# Altium schematic sheet POWER_Ctrl.SchDoc
size A4
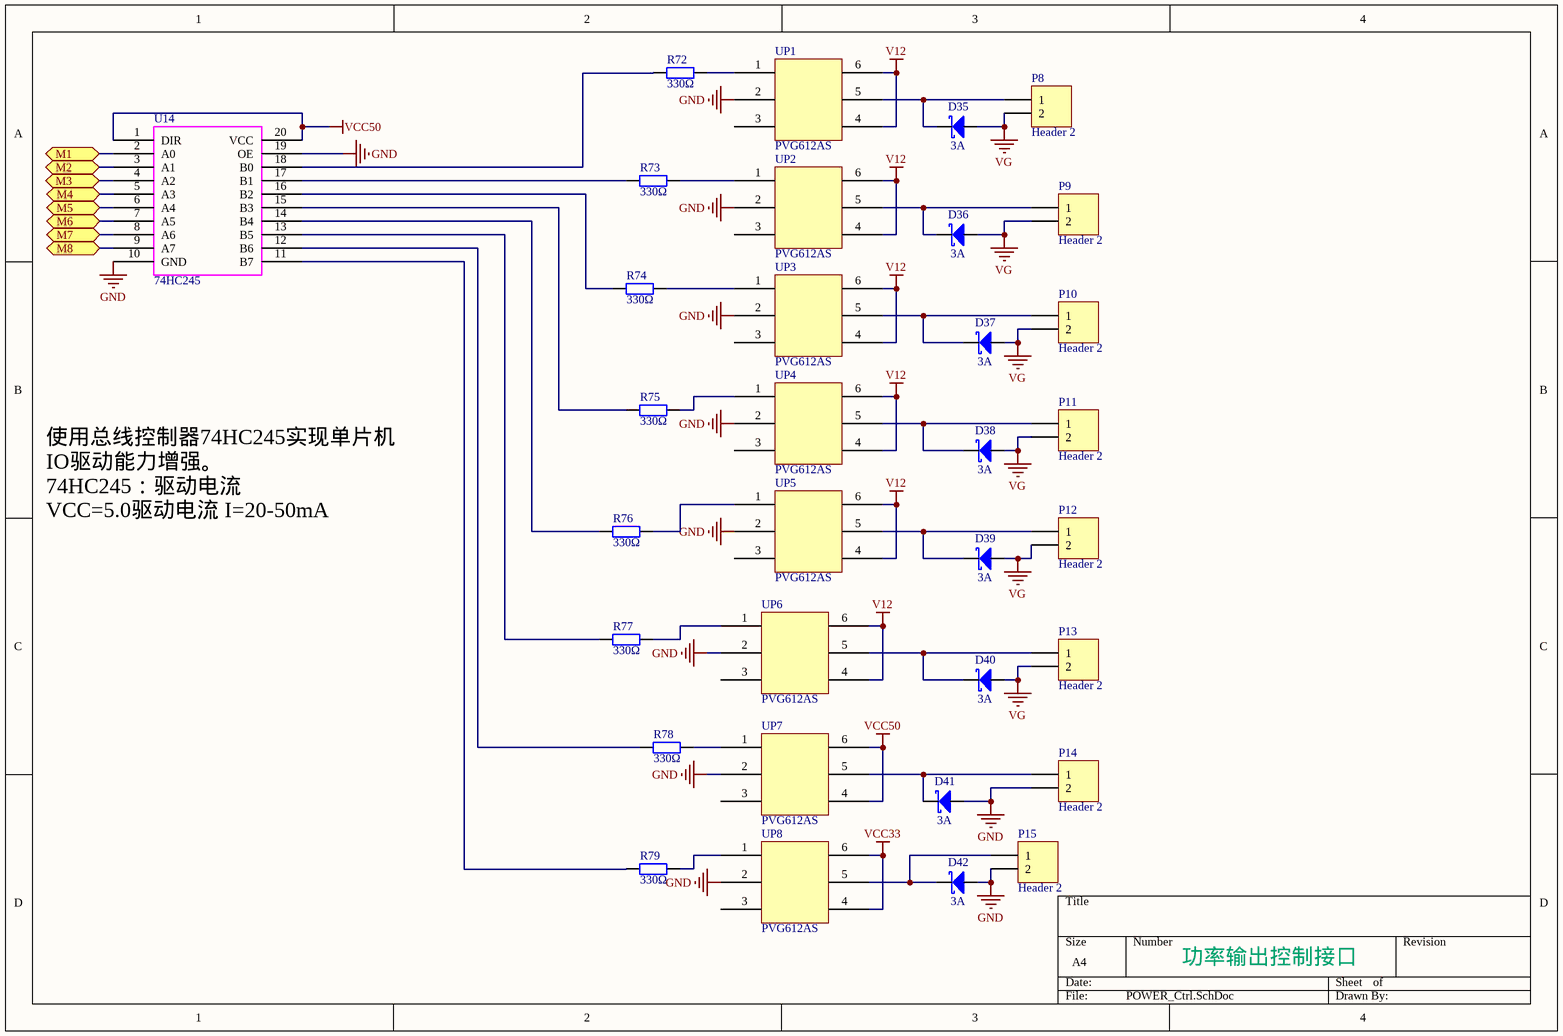
[diagram p0: POWER_Ctrl.SchDoc]

## Parts
D35  DIO Current: 3A  [SMA]  (hidden comment: DiodeSchottky)
D36  DIO Current: 3A  [SMA]  (hidden comment: DiodeSchottky)
D37  DIO Current: 3A  [SMA]  (hidden comment: DiodeSchottky)
D38  DIO Current: 3A  [SMA]  (hidden comment: DiodeSchottky)
D39  DIO Current: 3A  [SMA]  (hidden comment: DiodeSchottky)
D40  DIO Current: 3A  [SMA]  (hidden comment: DiodeSchottky)
D41  DIO Current: 3A  [SMA]  (hidden comment: DiodeSchottky)
D42  DIO Current: 3A  [SMA]  (hidden comment: DiodeSchottky)
P8  Header 2  [3.81-2P]
P9  Header 2  [3.81-2P]
P10  Header 2  [3.81-2P]
P11  Header 2  [3.81-2P]
P12  Header 2  [3.81-2P]
P13  Header 2  [3.81-2P]
P14  Header 2  [3.81-2P]
P15  Header 2  [3.81-2P]
R72  value 330Ω  [1206]  (hidden comment: Res2)
R73  value 330Ω  [1206]  (hidden comment: Res2)
R74  value 330Ω  [1206]  (hidden comment: Res2)
R75  value 330Ω  [1206]  (hidden comment: Res2)
R76  value 330Ω  [1206]  (hidden comment: Res2)
R77  value 330Ω  [1206]  (hidden comment: Res2)
R78  value 330Ω  [1206]  (hidden comment: Res2)
R79  value 330Ω  [1206]  (hidden comment: Res2)
U14  74HC245  [74HC245D]
UP1  PVG612AS  [SMD-6]
UP2  PVG612AS  [SMD-6]
UP3  PVG612AS  [SMD-6]
UP4  PVG612AS  [SMD-6]
UP5  PVG612AS  [SMD-6]
UP6  PVG612AS  [SMD-6]
UP7  PVG612AS  [SMD-6]
UP8  PVG612AS  [SMD-6]

## Ports
M1 (bidir), M2 (bidir), M3 (bidir), M4 (bidir), M5 (bidir), M6 (bidir), M7 (bidir), M8 (bidir)

## Nets
GND: D41.1 D42.1 P14.2 P15.2 U14.10(GND) U14.19(OE) UP1.2 UP2.2 UP3.2 UP4.2 UP5.2 UP6.2 UP7.2 UP8.2
V12: UP1.4 UP1.6 UP2.4 UP2.6 UP3.4 UP3.6 UP4.4 UP4.6 UP5.4 UP5.6 UP6.4 UP6.6
VCC33: UP8.4 UP8.6
VCC50: U14.1(DIR) U14.20(VCC) UP7.4 UP7.6
VG: D35.1 D36.1 D37.1 D38.1 D39.1 D40.1 P8.2 P9.2 P10.2 P11.2 P12.2 P13.2
M1: U14.2(A0) ; port M1
M2: U14.3(A1) ; port M2
M3: U14.4(A2) ; port M3
M4: U14.5(A3) ; port M4
M5: U14.6(A4) ; port M5
M6: U14.7(A5) ; port M6
M7: U14.8(A6) ; port M7
M8: U14.9(A7) ; port M8
NetD35_2: D35.2 P8.1 UP1.5
NetD36_2: D36.2 P9.1 UP2.5
NetD37_2: D37.2 P10.1 UP3.5
NetD38_2: D38.2 P11.1 UP4.5
NetD39_2: D39.2 P12.1 UP5.5
NetD40_2: D40.2 P13.1 UP6.5
NetD41_2: D41.2 P14.1 UP7.5
NetD42_2: D42.2 P15.1 UP8.5
NetR72_1: R72.1 UP1.1
NetR72_2: R72.2 U14.18(B0)
NetR73_1: R73.1 UP2.1
NetR73_2: R73.2 U14.17(B1)
NetR74_1: R74.1 UP3.1
NetR74_2: R74.2 U14.16(B2)
NetR75_1: R75.1 UP4.1
NetR75_2: R75.2 U14.15(B3)
NetR76_1: R76.1 UP5.1
NetR76_2: R76.2 U14.14(B4)
NetR77_1: R77.1 UP6.1
NetR77_2: R77.2 U14.13(B5)
NetR78_1: R78.1 UP7.1
NetR78_2: R78.2 U14.12(B6)
NetR79_1: R79.1 UP8.1
NetR79_2: R79.2 U14.11(B7)

Not connected (* = marked no-connect by the designer): UP1 3; UP2 3; UP3 3; UP4 3; UP5 3; UP6 3; UP7 3; UP8 3

## Notes on the sheet
- 使用总线控制器74HC245实现单片机IO驱动能力增强。
  74HC245：驱动电流
  VCC=5.0驱动电流 I=20-50mA
- 功率输出控制接口

## Library data of the parts
D35-D42 = DiodeSchottky: Godzilla; GeneracPartNumber: Temp0036; Manufacturer: MCC; Manufacturer Part Number: SS110-L; Drawing: S-297K; Substitutes Allowed: No; Operating Max Temp: 150; Operating Min Temp: -55; Circuit ID: ID; Engineering Notes: Notes; DIO Vreverse: 1000; RoHS Compliance: Yes; Mounting: Surface Mount; Package: SMA; DIO Type: Schottky; JEDEC: SS110-L
P8-P15 = Header 2: Header, 2-Pin; LatestRevisionDate: 17-Jul-2002; LatestRevisionNote: Re-released for DXP Platform.; Publisher: Altium Limited
R72-R79 = Res2: Resistor; Published: 8-Jun-2000; LatestRevisionDate: 17-Jul-2002; LatestRevisionNote: Re-released for DXP Platform.; PackageReference: AXIAL-0.4; Publisher: Altium Limited